# Altium schematic sheet ArtixConfig.SchDoc
size A
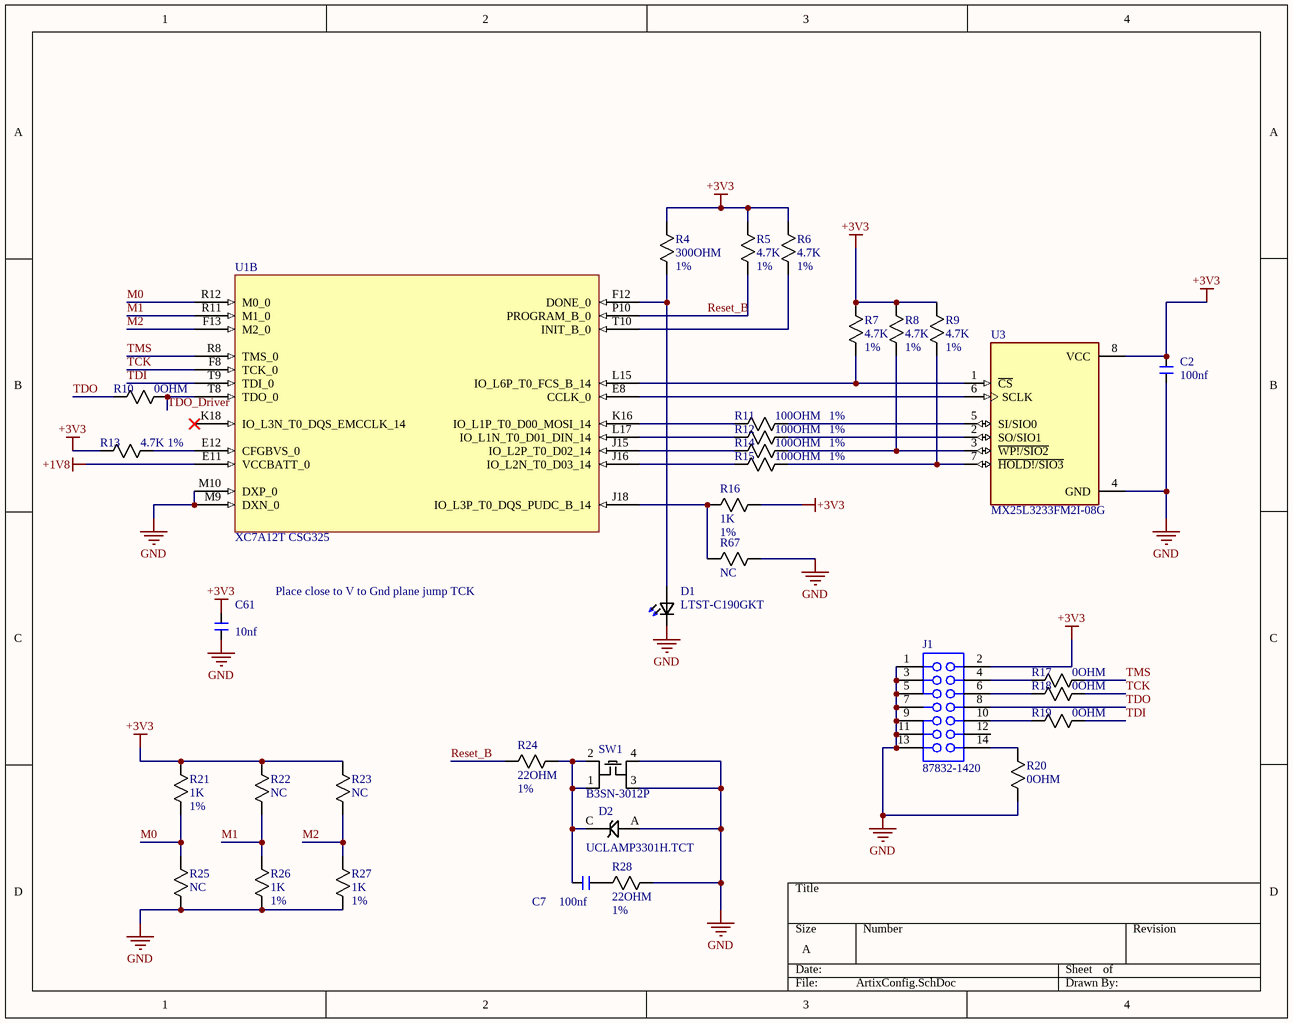
[diagram p0: ArtixConfig.SchDoc]

## Parts
C2  100nf  [0402Footprint]
C7  100nf  [0402Footprint]
C61  10nf  [0402Footprint]
D1  LTST-C190GKT  [0603]
D2  UCLAMP3301H.TCT  [SODFL160X70-2L]
J1  87832-1420  [MOLEX_87832-1420]
R4  300OHM  Tolerance: 1%  [RES_CRCW_0402]
R5  4.7K  Tolerance: 1%  [RES_CRCW_0402]
R6  4.7K  Tolerance: 1%  [RES_CRCW_0402]
R7  4.7K  Tolerance: 1%  [RES_CRCW_0402]
R8  4.7K  Tolerance: 1%  [RES_CRCW_0402]
R9  4.7K  Tolerance: 1%  [RES_CRCW_0402]
R10  0OHM  [RES_CRCW_0402]
R11  100OHM  Tolerance: 1%  [RES_CRCW_0402]
R12  100OHM  Tolerance: 1%  [RES_CRCW_0402]
R13  4.7K  Tolerance: 1%  [RES_CRCW_0402]
R14  100OHM  Tolerance: 1%  [RES_CRCW_0402]
R15  100OHM  Tolerance: 1%  [RES_CRCW_0402]
R16  1K  Tolerance: 1%  [RES_CRCW_0402]
R17  0OHM  [RES_CRCW_0402]
R18  0OHM  [RES_CRCW_0402]
R19  0OHM  [RES_CRCW_0402]
R20  0OHM  [RES_CRCW_0402]
R21  1K  Tolerance: 1%  [RES_CRCW_0402]
R22  NC  [RES_CRCW_0402]
R23  NC  [RES_CRCW_0402]
R24  22OHM  Tolerance: 1%  [RES_CRCW_0402]
R25  NC  [RES_CRCW_0402]
R26  1K  Tolerance: 1%  [RES_CRCW_0402]
R27  1K  Tolerance: 1%  [RES_CRCW_0402]
R28  22OHM  Tolerance: 1%  [RES_CRCW_0402]
R67  NC  [RES_CRCW_0402]
SW1  B3SN-3012P  [B3SN-3012P]
U1  XC7A12T CSG325  [BGA324C80P18X18_1500X1500X150]  (part B of 7)
U3  MX25L3233FM2I-08G  [SOIC127P790X216-8N_MX25L3233FM2I-08G]

## Nets
+1V8: U1.E11(VCCBATT_0)
+3V3: C2.1 C61.1 J1.2 R4.1 R5.1 R6.1 R7.1 R8.1 R9.1 R13.2 R16.1 R21.1 R22.1 R23.1 U3.8(VCC)
GND: C2.2 C61.2 D1.1(K2) D2.A J1.1 J1.3 J1.5 J1.7 J1.9 J1.11 J1.13 R20.1 R25.2 R26.2 R27.2 R28.1 R67.2 SW1.3 SW1.4 U1.M9(DXN_0) U1.M10(DXP_0) U3.4(GND)
M0: R21.2 R25.1 U1.R12(M0_0)
M1: R22.2 R26.1 U1.R11(M1_0)
M2: R23.2 R27.1 U1.F13(M2_0)
Reset_B: R5.2 R24.2 U1.P10(PROGRAM_B_0)
TCK: R18.1 U1.F8(TCK_0)
TDI: R19.1 U1.T9(TDI_0)
TDO: J1.8 R10.2
TDO_Driver: R10.1 U1.T8(TDO_0)
TMS: R17.1 U1.R8(TMS_0)
NetC7_1: C7.1 R28.2
NetC7_2: C7.2 D2.C R24.1 SW1.1 SW1.2
NetD1_2: D1.2(A2) R4.2 U1.F12(DONE_0)
NetJ1_4: J1.4 R17.2
NetJ1_6: J1.6 R18.2
NetJ1_10: J1.10 R19.2
NetJ1_14: J1.14 R20.2
NetR6_2: R6.2 U1.T10(INIT_B_0)
NetR7_2: R7.2 U1.L15(IO_L6P_T0_FCS_B_14) U3.1(~{CS})
NetR8_2: R8.2 R14.1 U3.3(~{WP!/SIO2})
NetR9_2: R9.2 R15.1 U3.7(~{HOLD!/SIO3})
NetR11_1: R11.1 U3.5(SI/SIO0)
NetR11_2: R11.2 U1.K16(IO_L1P_T0_D00_MOSI_14)
NetR12_1: R12.1 U3.2(SO/SIO1)
NetR12_2: R12.2 U1.L17(IO_L1N_T0_D01_DIN_14)
NetR13_1: R13.1 U1.E12(CFGBVS_0)
NetR14_2: R14.2 U1.J15(IO_L2P_T0_D02_14)
NetR15_2: R15.2 U1.J16(IO_L2N_T0_D03_14)
NetR16_2: R16.2 R67.1 U1.J18(IO_L3P_T0_DQS_PUDC_B_14)
NetU1_E8: U1.E8(CCLK_0) U3.6(SCLK)

Not connected (* = marked no-connect by the designer): J1 12; U1 K18(IO_L3N_T0_DQS_EMCCLK_14)*

## Notes on the sheet
- Place close to V to Gnd plane jump TCK

## Library data of the parts
C2 C7 = 100nf_0402: 0402; Manufacturer 1: *; Manufacturer Part Number 1: *
C61 = 10nf_0402: 0402; Manufacturer 1: *; Manufacturer Part Number 1: *
D1 = LTST-C190GKT: Green 569nm LED Indication - Discrete 2.1V 10mA 0603; Manufacturer: Lite-On Inc.; Availability: Unavailable; Package: 0603 Lite-On; Manufacturer Part Number 1: LTST-C190GKT
D2 = UCLAMP3301H.TCT: TVS Diode 3.3V 8V SOD523
J1 = 87832-1420: Connector Header Surface Mount 14 position 0.079 _2.00mm_; MF: Molex; MP: 87832-1420; Value: *; SnapEDA_Link: https://www.snapeda.com/parts/87832-1420/Molex/view-part/78740/?ref=snap; Price: None; Package: None; Availability: Unavailable
R4 = 300OHM_0402: 0402; Power: 1/10W; Manufacturer 1: *; Manufacturer Part Number 1: *
R5-R9 R13 = 4.7K_0402: 0402; Manufacturer 1: *; Manufacturer Part Number 1: *
R10 R17-R20 = 0OHM_0402: 0402; Manufacturer 1: *; Manufacturer Part Number 1: *
R11 R12 R14 R15 = 100OHM_0402: 0402; Manufacturer 1: *; Manufacturer Part Number 1: *
R16 R21 R26 R27 = 1k_0402: 0402; Manufacturer 1: *; Manufacturer Part Number 1: *
R22 R23 R25 R67 = NC_0402: Manufacturer 1: *; Manufacturer Part Number 1: *
R24 R28 = 22OHM_0402: 0402; Manufacturer 1: *; Manufacturer Part Number 1: *
SW1 = B3SN-3012P: Manufacturer: Omron; Mechanical Life: 100000Cycles; Contact Current Rating: 50mA; Operating Force: 1.57N; Voltage Rating (DC): 24V; Throw Configuration: SPST; Contact Resistance: 100mR; Illumination Type: Non-Illuminated,Illuminated; Number of Poles: 1; Electrical Life: 50000Cycles; Switch Travel: 0.25mm; Switch Function: Off-Mom; IP Rating: IP67,Waterproof,Dust Tight; Supplier 1: Digi-Key; Manufacturer Part Number: B3SN-3012P; Stock 1: 48000; Pricing 1: 3000=0.52365 (USD); Mount: Surface Mount; Case/Package: SMD/SMT; Weight: 0.007055oz; Contact Material: Gold; Contact Plating: Gold; Min Operating Temperature: -25°C; Max Operating Temperature: 70°C; Packaging: Tape and Reel; Max Voltage Rating (DC): 24V; Package Quantity: 1; Max Current Rating: 50mA; Current Rating: 50mA; Termination: SMD/SMT; Orientation: Straight; Length: 6.5mm; Height: 3.1mm; Depth: 7mm; Radiation Hardening: No; REACH SVHC: Unknown; Lead Free: Contains Lead; ComponentLink1URL: https://datasheet.ciiva.com/1532/en-b3sn-1532676.pdf; ComponentLink1Description: https://datasheet.ciiva.com/1532/en-b3sn-1532676.pdf; ComponentLink2URL: https://datasheet.ciiva.com/16154/en-b3sn-16154998.pdf; ComponentLink2Description: https://datasheet.ciiva.com/16154/en-b3sn-16154998.pdf; ComponentLink3URL: https://datasheet.ciiva.com/2900/b3sn-1110-2900023.pdf; ComponentLink3Description: https://datasheet.ciiva.com/2900/b3sn-1110-2900023.pdf; ComponentLink4URL: https://datasheet.ciiva.com/5283/en-b3sn-371257-5283623.pdf; ComponentLink4Description: https://datasheet.ciiva.com/5283/en-b3sn-371257-5283623.pdf; ComponentLink5URL: https://datasheet.ciiva.com/2900/b3sn-1110-2900024.pdf; ComponentLink5Description: https://datasheet.ciiva.com/2900/b3sn-1110-2900024.pdf; ComponentLink6URL: https://datasheet.ciiva.com/2900/b3sn-1110-2900025.pdf; ComponentLink6Description: https://datasheet.ciiva.com/2900/b3sn-1110-2900025.pdf; ComponentLink7URL: https://datasheet.ciiva.com/15183/getdatasheetpartid-87284-15183738.pdf; ComponentLink7Description: https://datasheet.ciiva.com/15183/getdatasheetpartid-87284-15183738.pdf; ComponentLink8URL: https://datasheet.ciiva.com/30076/en-b3sn-30076973.pdf; ComponentLink8Description: https://datasheet.ciiva.com/30076/en-b3sn-30076973.pdf; Supplier Part Number 1: SW261TR-ND
U1 = XC7A12T_1CSG325I
U3 = MX25L3233FM2I-08G: FLASH - NOR Memory IC 32Mb _8M x 4_ SPI - Quad I/O 133MHz 8-SOP; MF: Macronix; SnapEDA_Link: https://www.snapeda.com/parts/MX25L3233FM2I-08G/Macronix/view-part/2101968/?ref=snap; Price: None; MP: MX25L3233FM2I-08G; Package: SOIC-8 Macronix; Value: *; Availability: Unavailable